# EAGLE design IRconnector (EAGLE 5.10)
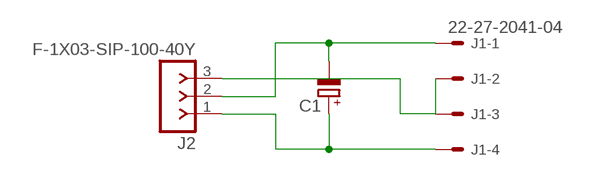
[diagram p0: schematic, sheet 1]

## Parts
C1  CPOL-EUE2.5-7  [E2,5-7]
J1  22-27-2041-04  [6410-04]
J2  F-1X03-SIP-100-40Y  [SIP-100-03-40Y]

## Nets
GND: C1.- J1.1 J2.2
N$1: J1.2 J1.3 J2.3
N$3: C1.+ J1.4 J2.1

## Library data of the parts
C1 = rcl:CPOL-EU: POLARIZED CAPACITOR, European symbol
J1 = con-molex:22-?-04: CONNECTOR wire to board 2.54 mm (.1 inch) pitch header; OC_FARNELL: unknown; OC_NEWARK: unknown
J2 = con-headers-jp:F-1X03-: FEMALE HEADER

## Board
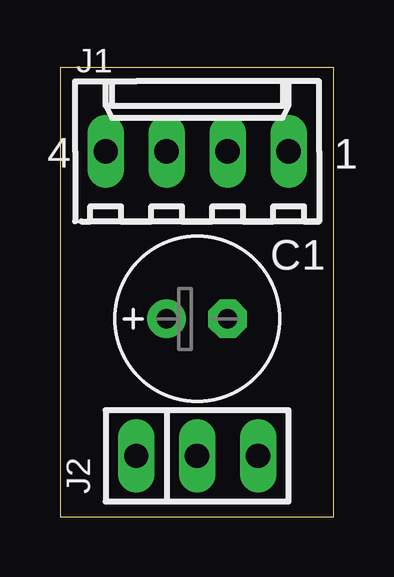
[diagram p1: board, top side]
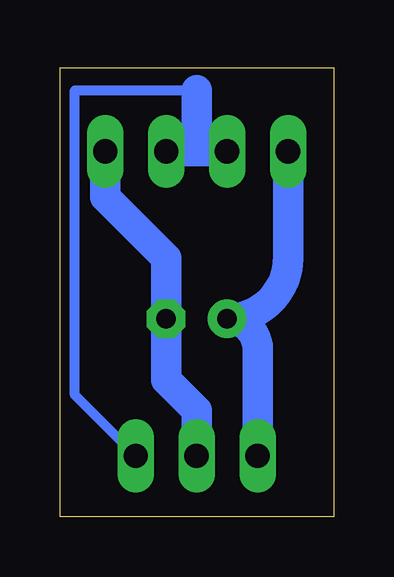
[diagram p2: board, bottom side, seen from below]

Size 11.41 x 18.72 mm. Coordinates in mm from the lower left corner, seen from the top.
Outline: 0,0 11.41,0 11.41,18.72 0,18.72 0,0
Copper layers (1*16): Top 0.035mm / dielectric 1.5mm / Bottom 0.035mm
Design rules "default": minimum track width 10mil, minimum drill 24mil, track to track 8mil, track to pad 8mil, pad to pad 8mil, via to via 8mil, smd to smd 8mil, copper to edge 40mil, drill to drill 8mil, minimum pad ring 10mil, minimum via ring 8mil, stop-mask expansion 4mil, vias tented up to drill 0mil, thermal gap 10mil

### Footprints (pad centres in the part's own frame; a part is rotated, then mirrored left to right if it is on the bottom)
E2,5-7 = drill 0.813 pad 1.6 round: + -1.27,0 | drill 0.813 pad 1.6 octagon: - 1.27,0
6410-04 = drill 1.016 long: 1 3.81,0; 2 1.27,0; 3 -1.27,0; 4 -3.81,0
SIP-100-03-40Y = drill 1.016 long: 1 -2.54,0; 2 0,0; 3 2.54,0

### Placement (x,y rotation side)
C1  5.71,8.26 0 top
J1  5.71,15.24 0 top
J2  5.71,2.54 0 top

### Tracks (layer width: path | path; a pad name or v marks a point on that pad's centre or on a via)
GND
  Bottom 1.27: J1.1 9.52,13.33 6.98,10.8 C1.- 6.98,5.72 5.71,4.45 J2.2
N$1
  Bottom 0.406: J2.3 10.79,5.08 10.79,17.78 5.71,17.78
  Bottom 1.27: 5.71,17.78 5.71,15.24 | 5.71,15.24 J1.3 | 5.71,15.24 J1.2
N$3
  Bottom 1.27: J1.4 1.9,10.8 arc90 C1.+ arc90 3.17,6.98 J2.1